# EAGLE design photon_pixel_shield_v1 (EAGLE 7.5.0)
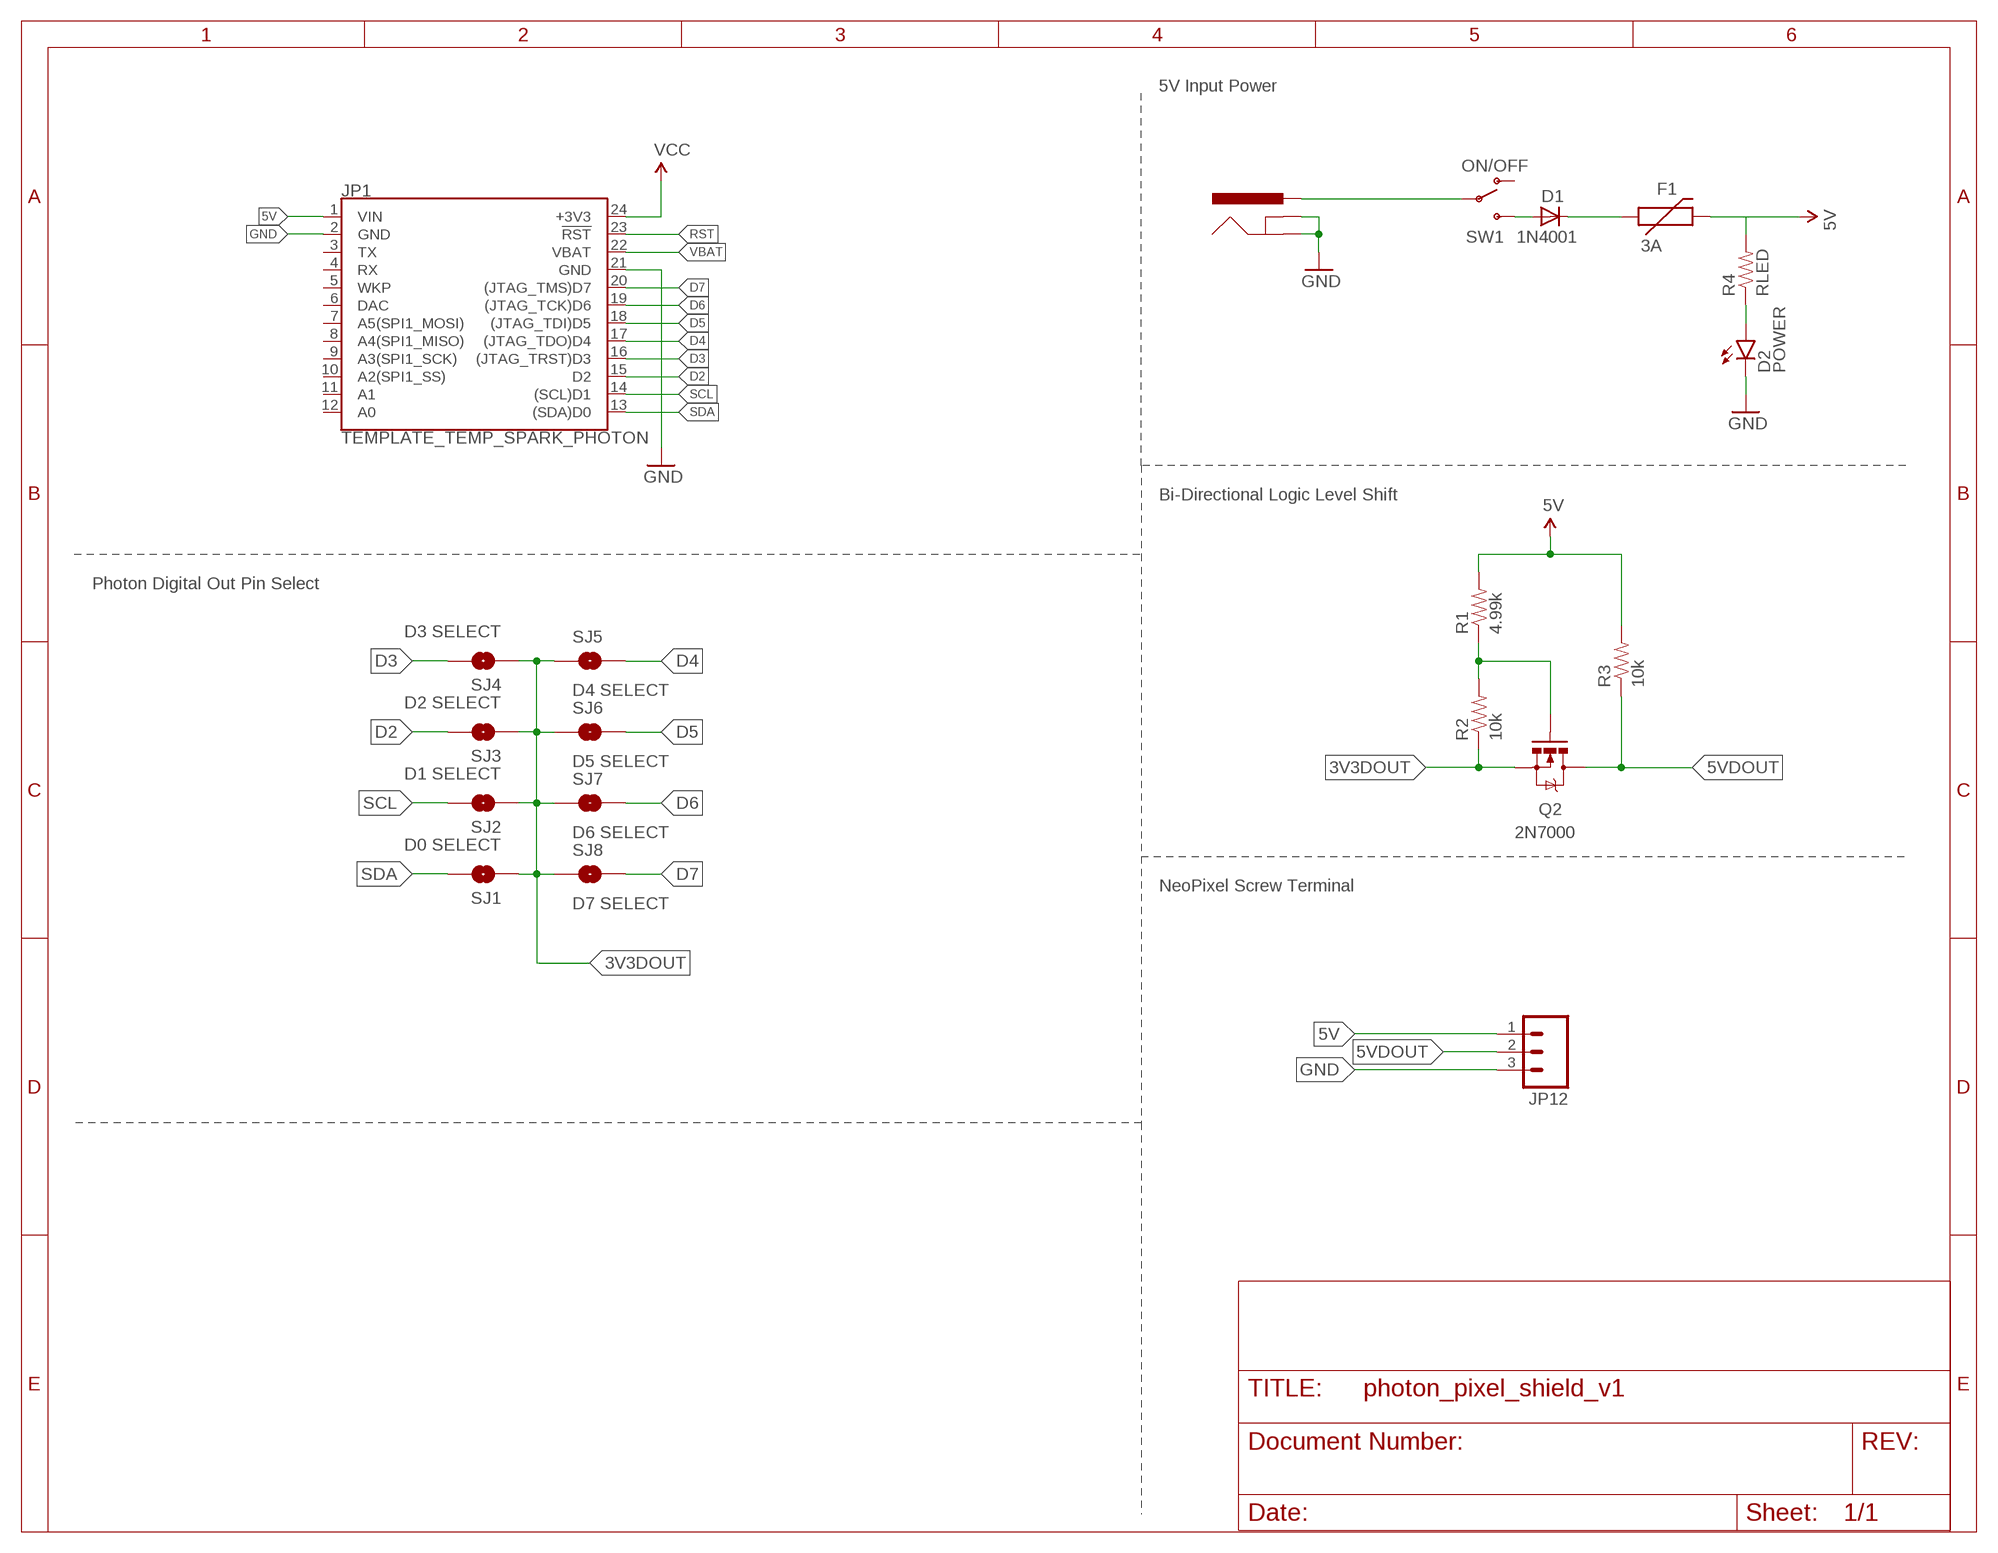
[diagram p0: schematic, sheet 1]

## Parts
D1  1N4001  DIODEPTH  [DIODE-0.4]
D2  POWER  LED3MM  [LED3MM]
F1  3A  PTCPTH  [PTC]
J1  POWER_JACKPTH  [POWER_JACK_PTH]
JP1  TEMPLATE_TEMP_SPARK_PHOTON  [TEMPLATE_TEMP_SPARK_PHOTON]
JP12  M03SCREW  [SCREWTERMINAL-3.5MM-3]
Q2  2N7000  MOSFET-NCHANNEL2N7000  [TO-92]
R1  4.99k  10KOHM-1/4W-1%(PTH)HORIZ  [AXIAL-0.3]
R2  10k  10KOHM-1/4W-1%(PTH)HORIZ  [AXIAL-0.3]
R3  10k  10KOHM-1/4W-1%(PTH)HORIZ  [AXIAL-0.3]
R4  RLED  10KOHM-1/4W-1%(PTH)HORIZ  [AXIAL-0.3]
SJ1  D0 SELECT  SOLDERJUMPERNO  [SJ_2S-NO]
SJ2  D1 SELECT  SOLDERJUMPERNO  [SJ_2S-NO]
SJ3  D2 SELECT  SOLDERJUMPERNO  [SJ_2S-NO]
SJ4  D3 SELECT  SOLDERJUMPERNO  [SJ_2S-NO]
SJ5  D4 SELECT  SOLDERJUMPERNO  [SJ_2S-NO]
SJ6  D5 SELECT  SOLDERJUMPERNO  [SJ_2S-NO]
SJ7  D6 SELECT  SOLDERJUMPERNO  [SJ_2S-NO]
SJ8  D7 SELECT  SOLDERJUMPERNO  [SJ_2S-NO]
SW1  ON/OFF  SWITCH-SPSTPTH  [SWITCH-SPST]

## Nets
3V3DOUT: Q2.1(S) R2.P$1 SJ1.1 SJ2.1 SJ3.1 SJ4.1 SJ5.1 SJ6.1 SJ7.1 SJ8.1
5V: F1.P$2 JP1.1(VIN) JP12.1 R1.P$2 R3.P$2 R4.P$2
5VDOUT: JP12.2 Q2.3(D) R3.P$1
D2: JP1.15(D2) SJ3.2
D3: JP1.16((JTAG_TRST)D3) SJ4.2
D4: JP1.17((JTAG_TDO)D4) SJ5.2
D5: JP1.18((JTAG_TDI)D5) SJ6.2
D6: JP1.19((JTAG_TCK)D6) SJ7.2
D7: JP1.20((JTAG_TMS)D7) SJ8.2
GND: D2.K(C) J1.GND J1.GNDBREAK JP1.2(GND) JP1.21(GND) JP12.3
N$1: D1.C F1.P$1
N$2: D1.A SW1.3(S)
N$3: J1.PWR SW1.2(P)
N$4: D2.A R4.P$1
N$10: Q2.2(G) R1.P$1 R2.P$2
RST: JP1.23(!RST!)
SCL: JP1.14((SCL)D1) SJ2.2
SDA: JP1.13((SDA)D0) SJ1.2
VBAT: JP1.22(VBAT)
VCC: JP1.24(+3V3)
Unconnected: JP1.3(TX) JP1.4(RX) JP1.5(WKP) JP1.6(DAC) JP1.7(A5(SPI1_MOSI)) JP1.8(A4(SPI1_MISO)) JP1.9(A3(SPI1_SCK)) JP1.10(A2(SPI1_SS)) JP1.11(A1) JP1.12(A0) SW1.1(O)

## Notes on the sheet
- 5V Input Power
- Bi-Directional Logic Level Shift
- Photon Digital Out Pin Select
- NeoPixel Screw Terminal

## Library data of the parts
D1 = SparkFun:DIODE: Diode These are standard reverse protection diodes and small signal diodes. SMA package can handle up to about 1A. SOD-323 can handle about 200mA. What the SOD-323 package when ordering, there are some mfgs out there that are 5-pin packages.
D2 = SparkFun-LED:LED: LEDs Standard schematic elements and footprints for 5mm, 3mm, 1206, and 0603 sized LEDs. 5mm - Spark Fun Electronics SKU : COM-00529 (and others)
F1 = SparkFun:PTC: Resettable Fuse PTC Resettable Fuse. Spark Fun Electronics SKU : COM-08357
J1 = SparkFun:POWER_JACK: Power Jack This is the standard 5.5mm barrel jack for power. The PTH is the most common, proven, reliable, footprint. All others are experimental. The Slot footprint only works if the mill layer is transmitted to the PCB fab house so be warned. Spark Fun Electronics SKU : PRT-00119. Mating wall wart : TOL-00298 (and others)
JP1 = Photon_Proto_Shield_v10:TEMPLATE_TEMP_SPARK_PHOTON
JP12 = SparkFun-Connectors:M03: Header 3 Standard 3-pin 0.1" header. Use with straight break away headers (SKU : PRT-00116), right angle break away headers (PRT-00553), swiss pins (PRT-00743), machine pins (PRT-00117), and female headers (PRT-00115). Molex polarized connector foot print use with SKU : PRT-08232 with associated crimp pins and housings.; PROD_ID: CONN-08288
Q2 = SparkFun-DiscreteSemi:MOSFET-NCHANNEL: Common NMOSFET Parts MFG P/N Store ID Prod ID FDD8780 TRANS-09984 SI7820DN TRANS-11055 FDS6630A IC-08089 2N7002PW TRANS-11151 FQP30N06L COM-10213 TRANS-10060 BSS123LT1G TRANS-08345 BSS138 TRANS-00830 BS170 2N7000
R1 R4 = SparkFun-Resistors:10KOHM-1/4W-1%(PTH): RES-12183; PROD_ID: RES-12183; VALUE: 10k
R2 R3 = SparkFun-Resistors:10KOHM-1/4W-1%(PTH): RES-12183; PROD_ID: RES-12183
SJ1-SJ8 = SparkFun-Retired:SOLDERJUMPER: Solder Jumper Standard SMD solder jumper. Used to automate production. Two varients : Normally Open and Normally Closed are the same, but have different paste layers. NC will have a large amount of paste and should jumper during reflow.
SW1 = SparkFun:SWITCH-SPST: SPST Switch Simple slide switch. Spark Fun Electronics SKU : COM-00102

## Board
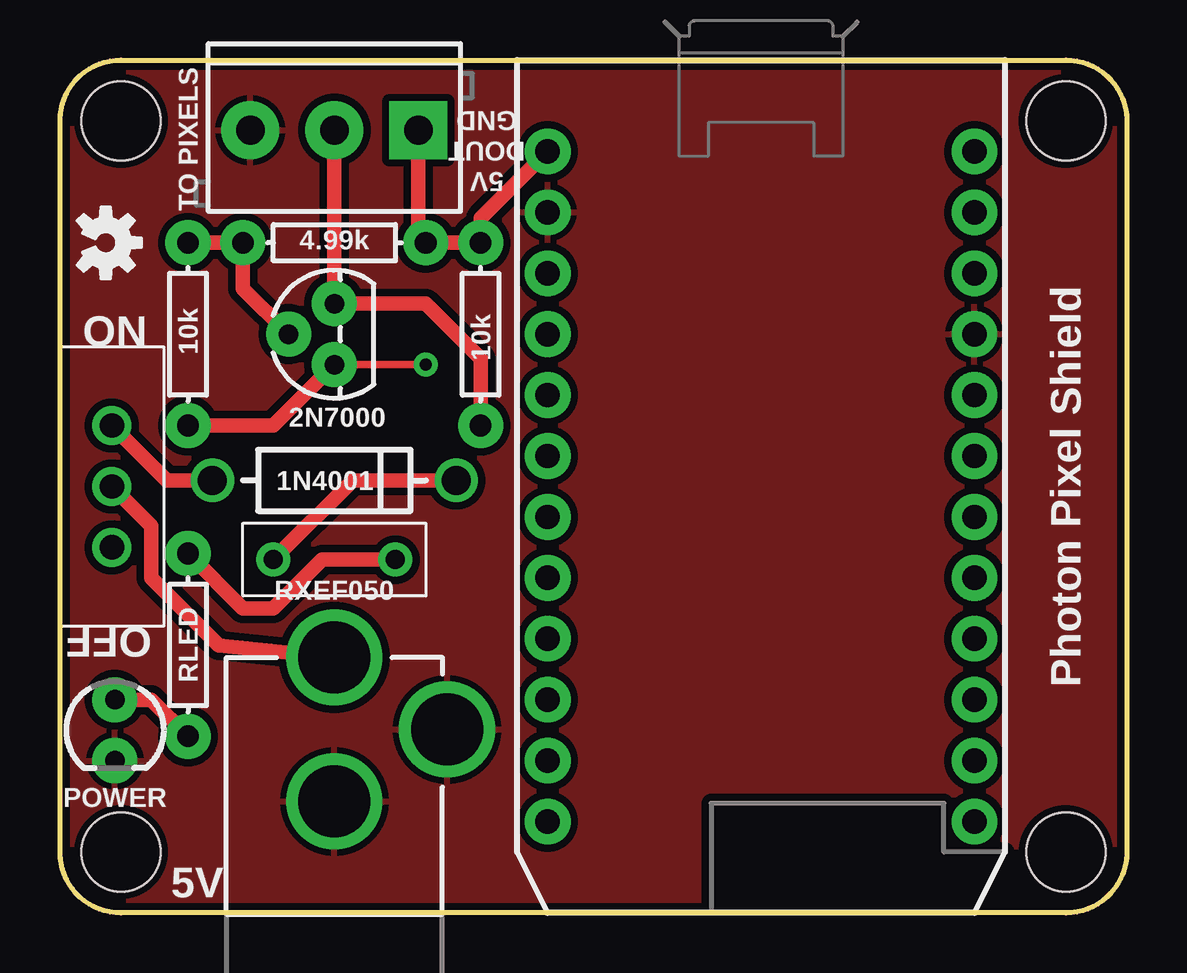
[diagram p1: board, top side]
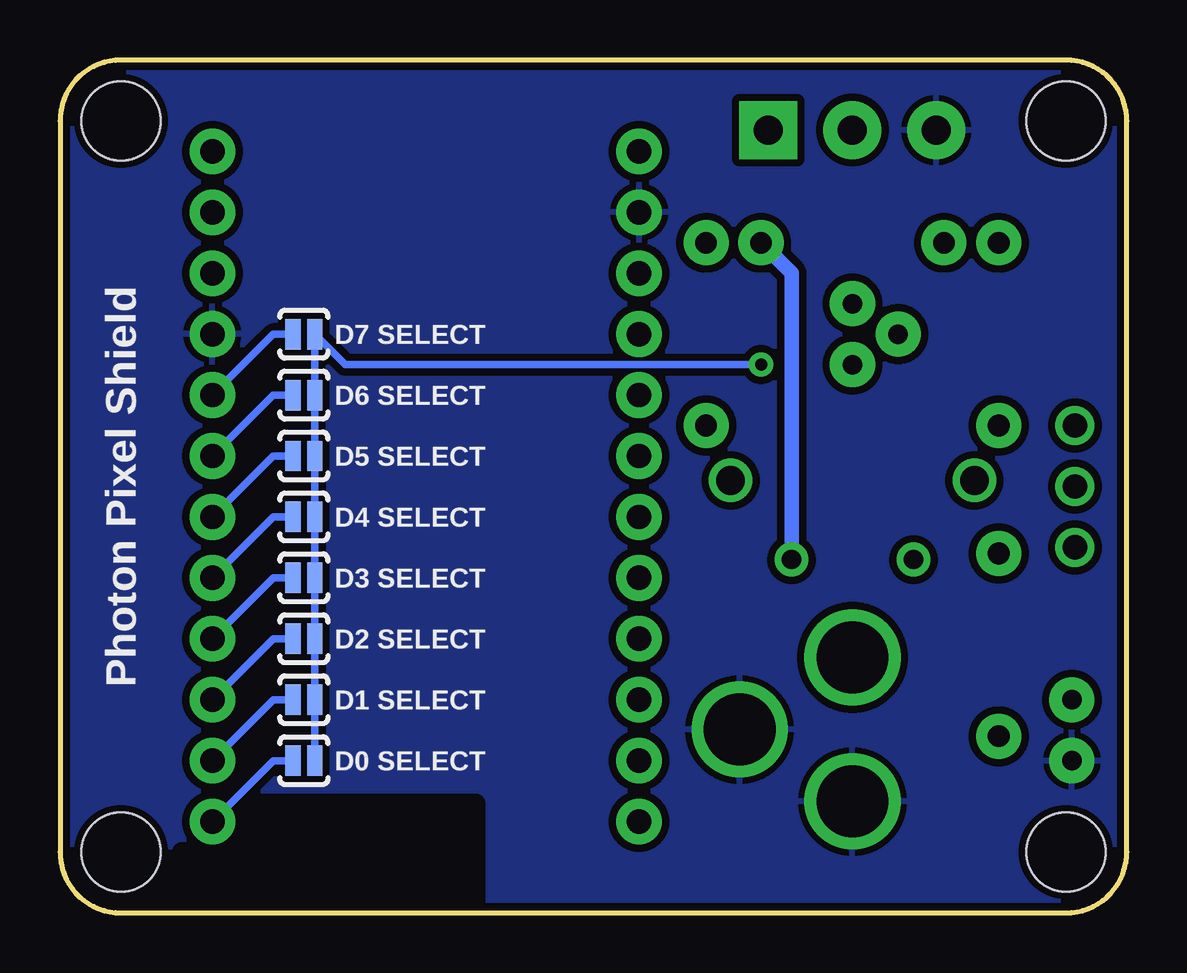
[diagram p2: board, bottom side, seen from below]

Size 44.45 x 35.56 mm. Coordinates in mm from the lower left corner, seen from the top.
Outline: 0,2.54 0,33.02 arc-90 2.54,35.56 41.91,35.56 arc-90 44.45,33.02 44.45,2.54 arc-90 41.91,0 2.54,0 arc-90 0,2.54
Copper layers (1*16): Top 0.035mm / dielectric 1.5mm / Bottom 0.035mm
Design rules "SparkFun-2-layer": minimum track width 7mil, minimum drill 15mil, track to track 8mil, track to pad 8mil, pad to pad 8mil, via to via 8mil, smd to smd 8mil, copper to edge 8mil, drill to drill 8mil, minimum pad ring 12mil, minimum via ring 10mil, stop-mask expansion 4mil, vias tented up to drill 20mil, thermal gap 10mil
Holes 3.3 mm at 41.91,2.54 41.91,33.02 2.54,33.02 2.54,2.54

### Footprints (pad centres in the part's own frame; a part is rotated, then mirrored left to right if it is on the bottom)
DIODE-0.4 = drill 1.2: A 0,0; C 10.16,0
LED3MM = drill 0.813 pad 1.88: A -1.27,0; K 1.27,0
PTC = drill 0.8: P$1 -2.54,0; P$2 2.54,0
POWER_JACK_PTH = drill 2.997: GND 0,7.7; GNDBREAK 4.7,10.7; PWR 0,13.7
TEMPLATE_TEMP_SPARK_PHOTON = drill 1.016 pad 1.905: 1 1.27,31.75; 2 1.27,29.21; 3 1.27,26.67; 4 1.27,24.13; 5 1.27,21.59; 6 1.27,19.05; 7 1.27,16.51; 8 1.27,13.97; 9 1.27,11.43; 10 1.27,8.89; 11 1.27,6.35; 12 1.27,3.81; 13 19.05,3.81; 14 19.05,6.35; 15 19.05,8.89; 16 19.05,11.43; 17 19.05,13.97; 18 19.05,16.51; 19 19.05,19.05; 20 19.05,21.59; 21 19.05,24.13; 22 19.05,26.67; 23 19.05,29.21; 24 19.05,31.75
SCREWTERMINAL-3.5MM-3 = drill 1.2 pad 2.413 square: 1 0,0 | drill 1.2 pad 2.413: 2 3.5,0; 3 7,0
TO-92 = drill 0.813 pad 1.88: 1 -1.27,0; 2 0,1.905; 3 1.27,0
AXIAL-0.3 = drill 0.9 pad 1.88: P$1 -3.81,0; P$2 3.81,0
SJ_2S-NO = smd 0.635 x 1.27: 1 -0.45,0; 2 0.45,0
SWITCH-SPST = drill 1.016: 1 0,2.54; 2 0,0; 3 0,-2.54

### Placement (x,y rotation side)
D1  6.35,18.03 0 top
D2  2.29,7.62 270 top
F1  11.43,14.73 0 top
J1  11.43,-3.05 0 top
JP1  19.05,0 0 top
JP12  14.94,32.64 180 top
Q2  11.43,24.13 90 top
R1  11.43,27.94 0 top
R2  5.33,24.13 90 top
R3  17.53,24.13 90 top
R4  5.33,11.18 90 top
SJ1  34.29,6.35 180 bottom
SJ2  34.29,8.89 180 bottom
SJ3  34.29,11.43 180 bottom
SJ4  34.29,13.97 180 bottom
SJ5  34.29,16.51 180 bottom
SJ6  34.29,19.05 180 bottom
SJ7  34.29,21.59 180 bottom
SJ8  34.29,24.13 180 bottom
SW1  2.16,17.78 180 top
U$1  [OSHW-LOGO-S]  1.91,27.94 270 top

### Tracks (layer width: path | path; a pad name or v marks a point on that pad's centre or on a via)
3V3DOUT  (via drill 0.5)
  Top 0.305: v15.24,22.86 Q2.1
  Top 0.61: Q2.1 8.89,20.32 R2.P$1
  Bottom 0.305: SJ1.1 SJ2.1 SJ3.1 SJ4.1 SJ5.1 SJ6.1 SJ7.1 SJ8.1 32.57,22.86 v15.24,22.86
5V
  Top 0.61: JP1.1 17.53,28.96 R3.P$2 R1.P$2 14.94,28.25 JP12.1 | F1.P$2 10.92,14.73 8.89,12.7 7.62,12.7 R4.P$2
  Bottom 0.61: F1.P$2 13.97,26.67 R1.P$2
5VDOUT
  Top 0.61: JP12.2 Q2.3 | Q2.3 | Q2.3 15.23,25.41 17.53,23.11 R3.P$1
D2
  Bottom 0.305: SJ3.2 35.56,11.43 JP1.15
D3
  Bottom 0.305: SJ4.2 35.56,13.97 JP1.16
D4
  Bottom 0.305: SJ5.2 35.56,16.51 JP1.17
D5
  Bottom 0.305: SJ6.2 35.56,19.05 JP1.18
D6
  Bottom 0.305: SJ7.2 35.56,21.59 JP1.19
D7
  Bottom 0.305: SJ8.2 35.56,24.13 JP1.20
GND
  pour Top (isolate 0.305): 0,35.56 0,0 44.45,0 44.45,35.56
  pour Bottom (isolate 0.305): 0,35.56 0,0 44.45,0 44.45,35.56
N$1
  Top 0.61: D1.C 12.19,18.03 F1.P$1
N$2
  Top 0.61: SW1.3 4.45,18.03 D1.A
N$3
  Top 0.61: SW1.2 3.81,16.13 3.81,13.97 6.62,11.16 J1.PWR
N$4
  Top 0.61: D2.A 3.81,8.89 R4.P$1
N$10
  Top 0.61: R2.P$2 R1.P$1 7.62,26.04 Q2.2
SCL
  Bottom 0.305: SJ2.2 35.56,8.89 JP1.14
SDA
  Bottom 0.305: SJ1.2 35.56,6.35 JP1.13

### Text on the board
tPlace: Photon Pixel Shield
tNames: GND | TO PIXELS | DOUT | 5V | ON | 1N4001 | RXEF050 | OFF | 5V
bNames: Photon Pixel Shield
Measures: Units in Inches